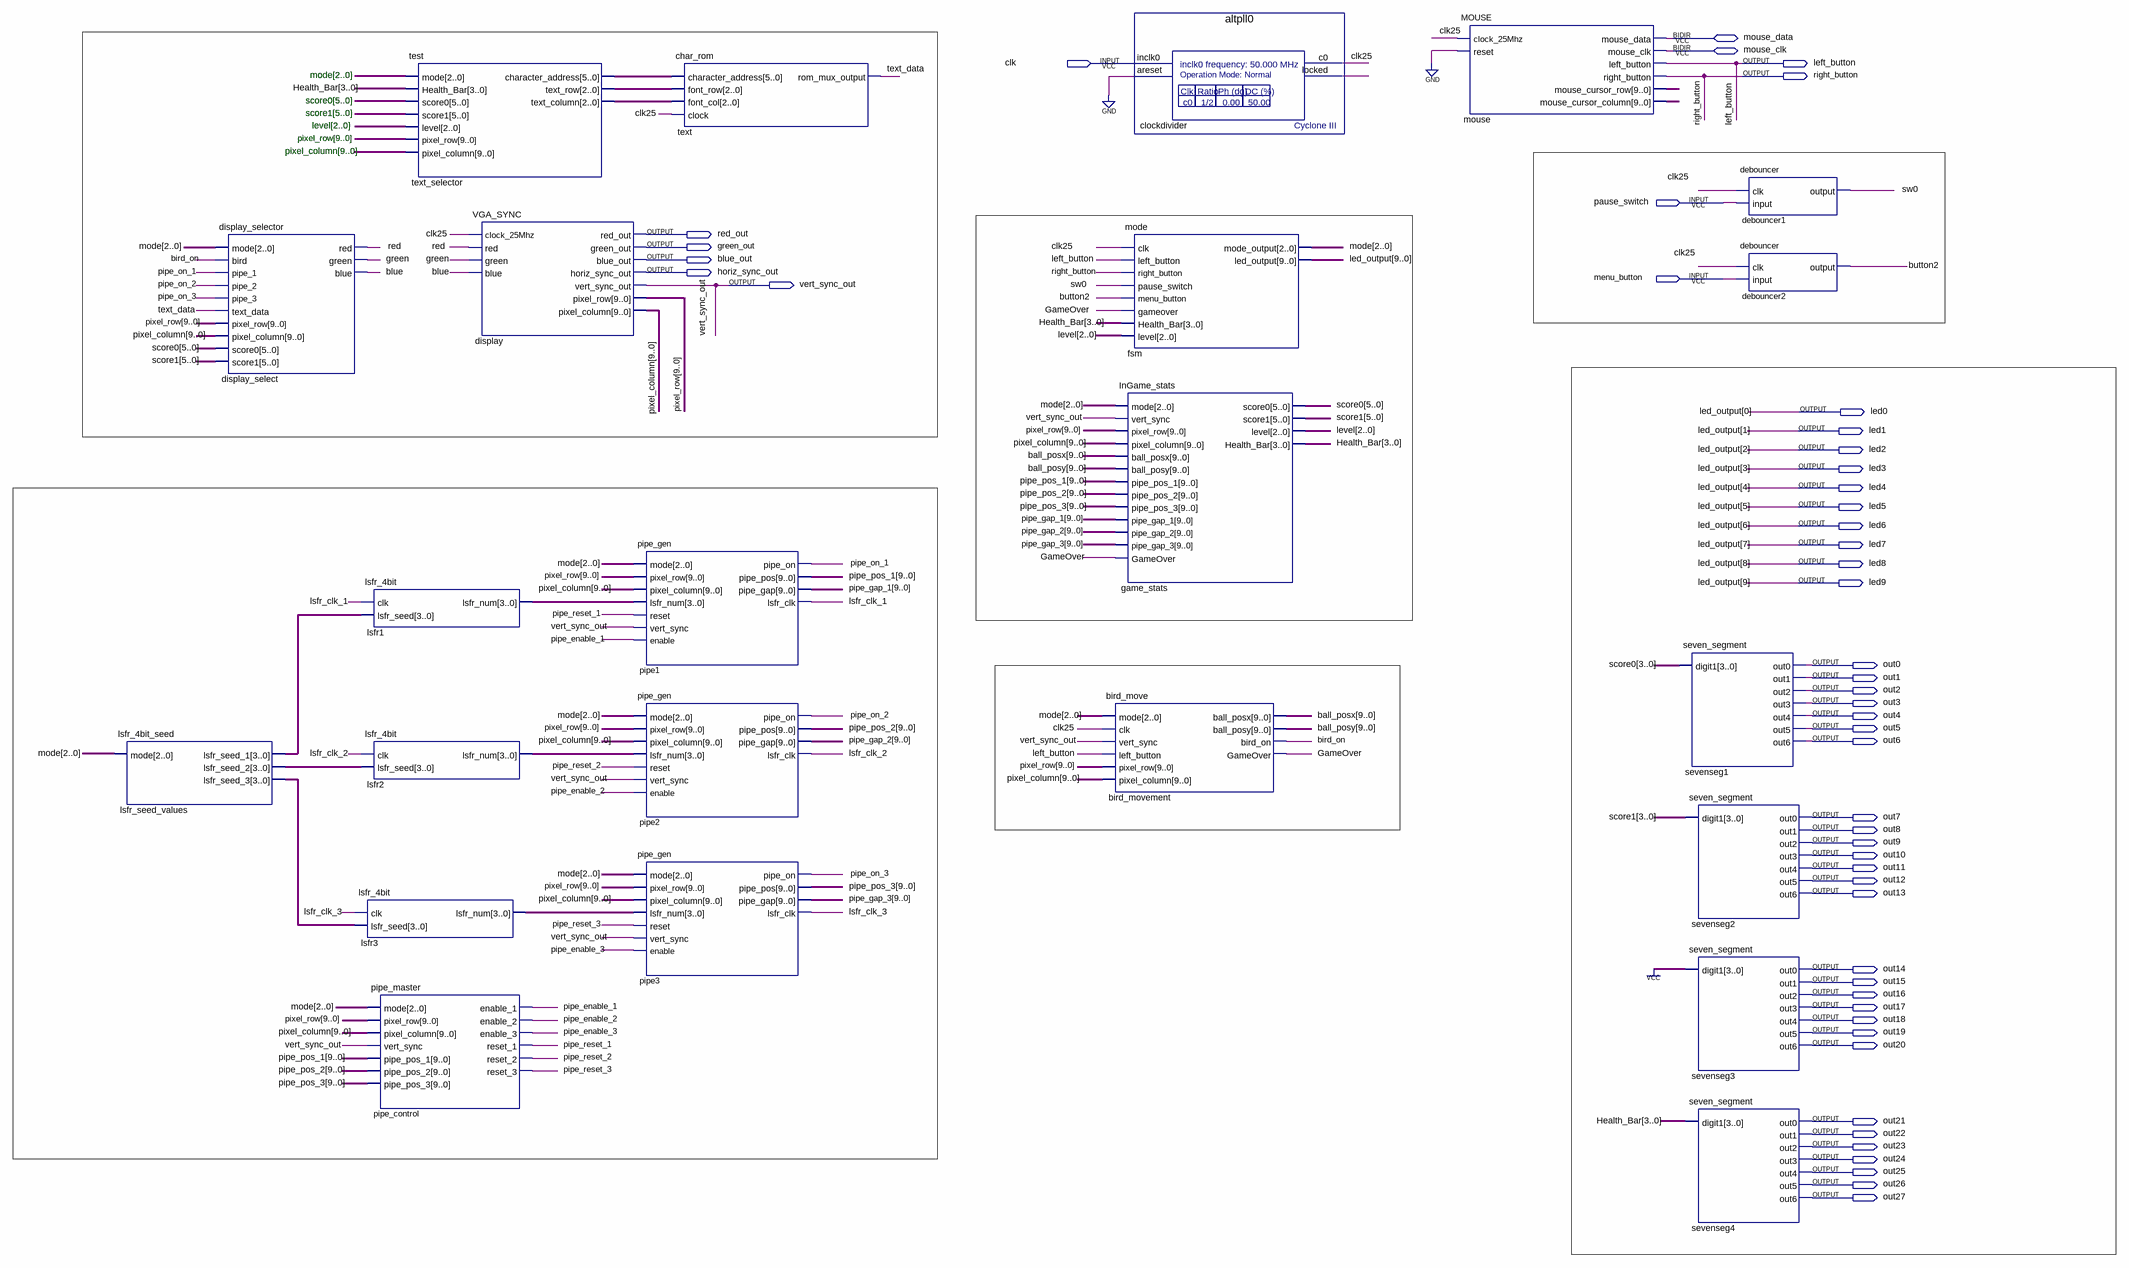
[diagram p0: schematic sheet]
// Quartus schematic interim.bdf as structural Verilog: 23 symbols, 50 pins
module interim (
  input  clk,
  input  pause_switch,
  input  menu_button,
  inout  mouse_data,
  inout  mouse_clk,
  output left_button,
  output right_button,
  output red_out,
  output green_out,
  output blue_out,
  output horiz_sync_out,
  output vert_sync_out,
  output led0,
  output led1,
  output led2,
  output led3,
  output led4,
  output led5,
  output led6,
  output led7,
  output led8,
  output led9,
  output out0,
  output out1,
  output out2,
  output out3,
  output out4,
  output out5,
  output out6,
  output out7,
  output out8,
  output out9,
  output out10,
  output out11,
  output out12,
  output out13,
  output out14,
  output out15,
  output out16,
  output out17,
  output out18,
  output out19,
  output out20,
  output out21,
  output out22,
  output out23,
  output out24,
  output out25,
  output out26,
  output out27
);

  wire bird_on, blue, button2, clk25, clockdivider_locked, GameOver, green, lsfr_clk_1, lsfr_clk_2,
       lsfr_clk_3, pipe_enable_1, pipe_enable_2, pipe_enable_3, pipe_on_1, pipe_on_2, pipe_on_3,
       pipe_reset_1, pipe_reset_2, pipe_reset_3, red, sw0, text_data;
  wire [2:0] level, mode, text_selector_text_column, text_selector_text_row;
  wire [3:0] Health_Bar, lsfr1_lsfr_num, lsfr2_lsfr_num, lsfr3_lsfr_num, lsfr_seed_values_lsfr_seed_1,
       lsfr_seed_values_lsfr_seed_2, lsfr_seed_values_lsfr_seed_3;
  wire [5:0] score0, score1, text_selector_character_address;
  wire [9:0] ball_posx, ball_posy, mouse_mouse_cursor_column, mouse_mouse_cursor_row, pipe_gap_1, pipe_gap_2,
       pipe_gap_3, pipe_pos_1, pipe_pos_2, pipe_pos_3, pixel_column, pixel_row;

  lsfr_4bit_seed lsfr_seed_values (
    .mode(mode), .lsfr_seed_1(lsfr_seed_values_lsfr_seed_1), .lsfr_seed_2(lsfr_seed_values_lsfr_seed_2),
    .lsfr_seed_3(lsfr_seed_values_lsfr_seed_3));
  display_selector display_select (
    .mode(mode), .bird(bird_on), .pipe_1(pipe_on_1), .pipe_2(pipe_on_2), .pipe_3(pipe_on_3),
    .text_data(text_data), .pixel_row(pixel_row), .pixel_column(pixel_column), .score0(score0),
    .score1(score1), .red(red), .green(green), .blue(blue));
  lsfr_4bit lsfr3 (.clk(lsfr_clk_3), .lsfr_seed(lsfr_seed_values_lsfr_seed_3), .lsfr_num(lsfr3_lsfr_num));
  test text_selector (
    .mode(mode), .Health_Bar(Health_Bar), .score0(score0), .score1(score1), .level(level),
    .pixel_row(pixel_row), .pixel_column(pixel_column), .character_address(text_selector_character_address),
    .text_row(text_selector_text_row), .text_column(text_selector_text_column));
  lsfr_4bit lsfr1 (.clk(lsfr_clk_1), .lsfr_seed(lsfr_seed_values_lsfr_seed_1), .lsfr_num(lsfr1_lsfr_num));
  lsfr_4bit lsfr2 (.clk(lsfr_clk_2), .lsfr_seed(lsfr_seed_values_lsfr_seed_2), .lsfr_num(lsfr2_lsfr_num));
  pipe_master pipe_control (
    .mode(mode), .pixel_row(pixel_row), .pixel_column(pixel_column), .vert_sync(vert_sync_out),
    .pipe_pos_1(pipe_pos_1), .pipe_pos_2(pipe_pos_2), .pipe_pos_3(pipe_pos_3), .enable_1(pipe_enable_1),
    .enable_2(pipe_enable_2), .enable_3(pipe_enable_3), .reset_1(pipe_reset_1), .reset_2(pipe_reset_2),
    .reset_3(pipe_reset_3));
  VGA_SYNC display (
    .clock_25Mhz(clk25), .red(red), .green(green), .blue(blue), .red_out(red_out), .green_out(green_out),
    .blue_out(blue_out), .horiz_sync_out(horiz_sync_out), .vert_sync_out(vert_sync_out),
    .pixel_row(pixel_row), .pixel_column(pixel_column));
  pipe_gen pipe1 (
    .mode(mode), .pixel_row(pixel_row), .pixel_column(pixel_column), .lsfr_num(lsfr1_lsfr_num),
    .reset(pipe_reset_1), .vert_sync(vert_sync_out), .enable(pipe_enable_1), .pipe_on(pipe_on_1),
    .pipe_pos(pipe_pos_1), .pipe_gap(pipe_gap_1), .lsfr_clk(lsfr_clk_1));
  pipe_gen pipe2 (
    .mode(mode), .pixel_row(pixel_row), .pixel_column(pixel_column), .lsfr_num(lsfr2_lsfr_num),
    .reset(pipe_reset_2), .vert_sync(vert_sync_out), .enable(pipe_enable_2), .pipe_on(pipe_on_2),
    .pipe_pos(pipe_pos_2), .pipe_gap(pipe_gap_2), .lsfr_clk(lsfr_clk_2));
  pipe_gen pipe3 (
    .mode(mode), .pixel_row(pixel_row), .pixel_column(pixel_column), .lsfr_num(lsfr3_lsfr_num),
    .reset(pipe_reset_3), .vert_sync(vert_sync_out), .enable(pipe_enable_3), .pipe_on(pipe_on_3),
    .pipe_pos(pipe_pos_3), .pipe_gap(pipe_gap_3), .lsfr_clk(lsfr_clk_3));
  char_rom text (
    .character_address(text_selector_character_address), .font_row(text_selector_text_row),
    .font_col(text_selector_text_column), .clock(clk25), .rom_mux_output(text_data));
  InGame_stats game_stats (
    .mode(mode), .vert_sync(vert_sync_out), .pixel_row(pixel_row), .pixel_column(pixel_column),
    .ball_posx(ball_posx), .ball_posy(ball_posy), .pipe_pos_1(pipe_pos_1), .pipe_pos_2(pipe_pos_2),
    .pipe_pos_3(pipe_pos_3), .pipe_gap_1(pipe_gap_1), .pipe_gap_2(pipe_gap_2), .pipe_gap_3(pipe_gap_3),
    .GameOver(GameOver), .score0(score0), .score1(score1), .level(level), .Health_Bar(Health_Bar));
  bird_move bird_movement (
    .mode(mode), .clk(clk25), .vert_sync(vert_sync_out), .left_button(left_button), .pixel_row(pixel_row),
    .pixel_column(pixel_column), .ball_posx(ball_posx), .ball_posy(ball_posy), .bird_on(bird_on),
    .GameOver(GameOver));
  altpll0 clockdivider (.inclk0(clk), .areset(1'b0), .c0(clk25), .locked(clockdivider_locked));
  mode fsm (
    .clk(clk25), .left_button(left_button), .right_button(right_button), .pause_switch(sw0),
    .menu_button(button2), .gameover(GameOver), .Health_Bar(Health_Bar), .level(level), .mode_output(mode),
    .led_output({led9, led8, led7, led6, led5, led4, led3, led2, led1, led0}));
  MOUSE mouse (
    .clock_25Mhz(clk25), .reset(1'b0), .left_button(left_button), .right_button(right_button),
    .mouse_cursor_row(mouse_mouse_cursor_row), .mouse_cursor_column(mouse_mouse_cursor_column),
    .mouse_data(mouse_data), .mouse_clk(mouse_clk));
  seven_segment sevenseg1 (
    .digit1(score0[3:0]), .out0(out0), .out1(out1), .out2(out2), .out3(out3), .out4(out4), .out5(out5),
    .out6(out6));
  seven_segment sevenseg2 (
    .digit1(score1[3:0]), .out0(out7), .out1(out8), .out2(out9), .out3(out10), .out4(out11), .out5(out12),
    .out6(out13));
  seven_segment sevenseg3 (
    .digit1(4'b1111), .out0(out14), .out1(out15), .out2(out16), .out3(out17), .out4(out18), .out5(out19),
    .out6(out20));
  seven_segment sevenseg4 (
    .digit1(Health_Bar), .out0(out21), .out1(out22), .out2(out23), .out3(out24), .out4(out25), .out5(out26),
    .out6(out27));
  debouncer debouncer1 (.clk(clk25), .\input (pause_switch), .\output (sw0));
  debouncer debouncer2 (.clk(clk25), .\input (menu_button), .\output (button2));

  // Other names for the same wires on the sheet: led_output[9:0] = {led9, led8, led7, led6, led5, led4, led3, led2, led1, led0}

  // Notes on the sheet:
  //   mode[2..0]
  //   score0[5..0]
  //   score1[5..0]
  //   level[2..0]
  //   pixel_row[9..0]
  //   pixel_column[9..0]
endmodule
